# EAGLE design USBasp (EAGLE 5.07)
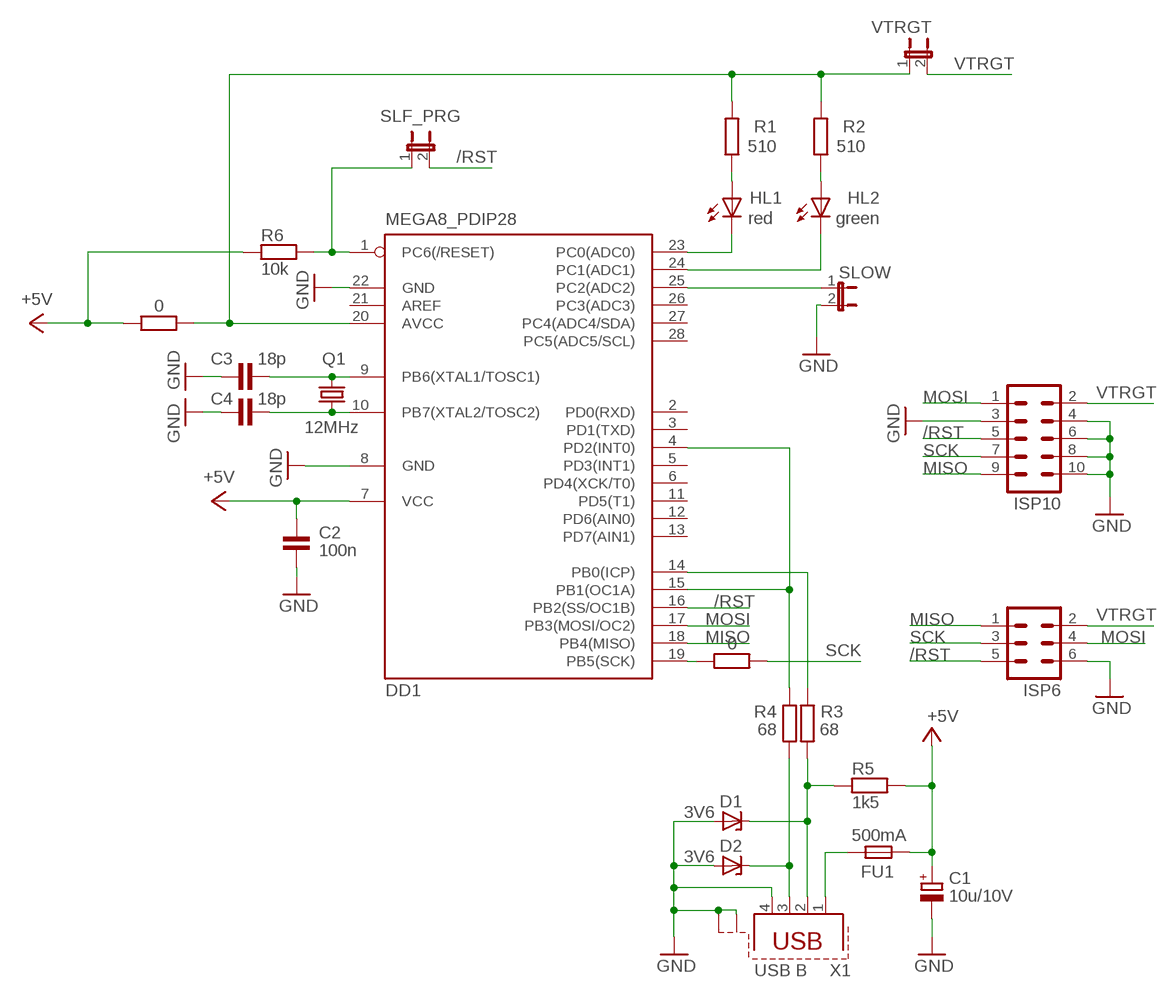
[diagram p0: schematic, sheet 1]

## Parts
C1  10u/10V  CPOL-EUSMCA  [SMC_A]
C2  100n  CAPACITOR_SMD1206  [C_SMD1206]
C3  18p  CAPACITOR_SMD1206  [C_SMD1206]
C4  18p  CAPACITOR_SMD1206  [C_SMD1206]
D1  3V6  1N4729_7.6MM  [ZD_7.6MM]
D2  3V6  1N4729_7.6MM  [ZD_7.6MM]
DD1  MEGA8_PDIP28  [DIL28]
FU1  500mA  MF-R  [TE5]
HL1  red  LED3MM  [LED3MM]
HL2  green  LED3MM  [LED3MM]
ISP6  MA03-2  [MA03-2]
ISP10  ML10_10L  [ML10L]
Q1  12MHz  CRYSTALHC49U-V  [HC49U-V]
R1  510  RESISTOR_SMD1206  [R_SMD1206]
R2  510  RESISTOR_SMD1206  [R_SMD1206]
R3  68  RESISTOR_SMD0805  [R_SMD0805]
R4  68  RESISTOR_SMD0805  [R_SMD0805]
R5  1k5  RESISTOR_SMD1206  [R_SMD1206]
R6  10k  RESISTOR_SMD1206  [R_SMD1206]
SLF_PRG  JP1E  [JP1]
SLOW  JP1E  [JP1]
U$1  R0_SMD1206  [R0_SMD1206]
U$2  R0_SMD1206  [R0_SMD1206]
VTRGT  JP1E  [JP1]
X1  USB B  USB_B  [USB_B]

## Nets
/RST: DD1.16(PB2(SS/OC1B)) ISP6.5 ISP10.5 SLF_PRG.2
GND: C1.- C2.2 C3.1 C4.1 D1.A D2.A DD1.8(GND) DD1.22(GND) ISP6.6 ISP10.3 ISP10.4 ISP10.6 ISP10.8 ISP10.10 SLOW.2 X1.4 X1.S1 X1.S2
MISO: DD1.18(PB4(MISO)) ISP6.1 ISP10.9
MOSI: DD1.17(PB3(MOSI/OC2)) ISP6.4 ISP10.1
N$1: DD1.23(PC0(ADC0)) HL1.K(C)
N$2: HL1.A R1.1
N$3: HL2.A R2.1
N$4: DD1.24(PC1(ADC1)) HL2.K(C)
N$5: FU1.1 X1.1
N$9: DD1.14(PB0(ICP)) R3.2
N$10: D1.C R3.1 R5.2 X1.2
N$11: C3.2 DD1.9(PB6(XTAL1/TOSC1)) Q1.2
N$12: D2.C R4.1 X1.3
N$14: DD1.4(PD2(INT0)) DD1.15(PB1(OC1A)) R4.2
N$15: C4.2 DD1.10(PB7(XTAL2/TOSC2)) Q1.1
N$16: DD1.19(PB5(SCK)) U$2.1
N$17: DD1.25(PC2(ADC2)) SLOW.1
N$21: DD1.20(AVCC) R1.2 R2.2 U$1.2 VTRGT.1
RST: DD1.1(PC6(/RESET)) R6.1 SLF_PRG.1
SCK: ISP6.3 ISP10.7 U$2.2
VCC: C1.+ C2.1 DD1.7(VCC) FU1.2 R5.1 R6.2 U$1.1 ; supply symbol labelled +5V
VTRGT: ISP6.2 ISP10.2 VTRGT.2
Unconnected: DD1.2(PD0(RXD)) DD1.3(PD1(TXD)) DD1.5(PD3(INT1)) DD1.6(PD4(XCK/T0)) DD1.11(PD5(T1)) DD1.12(PD6(AIN0)) DD1.13(PD7(AIN1)) DD1.21(AREF) DD1.26(PC3(ADC3)) DD1.27(PC4(ADC4/SDA)) DD1.28(PC5(ADC5/SCL))

## Library data of the parts
C1 = RLC:CPOL-EU: POLARIZED CAPACITOR, European symbol
C2-C4 = RLC:CAPACITOR_: Capacitor
D1 D2 = Diode:1N4729_: Zener Diode 3V6, 1W, 5 percent
DD1 = AVR:MEGA8_: MICROCONTROLLER 8 Kbytes FLASH, 1 kbytes SRAM, 512 bytes EEPROM, USART, 4-channel 10 bit ADC, 2-channel 8 bit ADC Pin compatible with Atmega48, ATMega88, ATMega168 Source: avr.lbr
FU1 = Fuse:MF-R: Resettable Fuse Bourns
HL1 HL2 = led:LED: LED OSRAM: - CHIPLED LG R971, LG N971, LY N971, LG Q971, LY Q971, LO R971, LY R971 LH N974, LH R974 LS Q976, LO Q976, LY Q976 LO Q996 - Hyper CHIPLED LW Q18S LB Q993, LB Q99A, LB R99A - SideLED LS A670, LO A670, LY A670, LG A670, LP A670 LB A673, LV A673, LT A673, LW A673 LH A674 LY A675 LS A676, LA A676, LO A676, LY A676, LW A676 LS A679, LY A679, LG A679 - Hyper Micro SIDELED® LS Y876, LA Y876, LO Y876, LY Y876 LT Y87S - SmartLED LW L88C, LW L88S LB L89C, LB L89S, LG L890 LS L89K, LO L89K, LY L89K LS L896, LA L896, LO L896, LY L896 - TOPLED LS T670, LO T670, LY T670, LG T670, LP T670 LSG T670, LSP T670, LSY T670, LOP T670, LYG T670 LG T671, LOG T671, LSG T671 LB T673, LV T673, LT T673, LW T673 LH T674 LS T676, LA T676, LO T676, LY T676, LB T676, LH T676, LSB T676, LW T676 LB T67C, LV T67C, LT T67C, LS T67K, LO T67K, LY T67K, LW E67C LS E67B, LA E67B, LO E67B, LY E67B, LB E67C, LV E67C, LT E67C LW T67C LS T679, LY T679, LG T679 LS T770, LO T770, LY T770, LG T770, LP T770 LB T773, LV T773, LT T773, LW T773 LH T774 LS E675, LA E675, LY E675, LS T675 LS T776, LA T776, LO T776, LY T776, LB T776 LHGB T686 LT T68C, LB T68C - Hyper Mini TOPLED® LB M676 - Mini TOPLED Santana® LG M470 LS M47K, LO M47K, LY M47K Source: http://www.osram.convergy.de LUXEON: - LUMILED® LXK2-PW12-R00, LXK2-PW12-S00, LXK2-PW14-U00, LXK2-PW14-V00 LXK2-PM12-R00, LXK2-PM12-S00, LXK2-PM14-U00 LXK2-PE12-Q00, LXK2-PE12-R00, LXK2-PE12-S00, LXK2-PE14-T00, LXK2-PE14-U00 LXK2-PB12-K00, LXK2-PB12-L00, LXK2-PB12-M00, LXK2-PB14-N00, LXK2-PB14-P00, LXK2-PB14-Q00 LXK2-PR12-L00, LXK2-PR12-M00, LXK2-PR14-Q00, LXK2-PR14-R00 LXK2-PD12-Q00, LXK2-PD12-R00, LXK2-PD12-S00 LXK2-PH12-R00, LXK2-PH12-S00 LXK2-PL12-P00, LXK2-PL12-Q00, LXK2-PL12-R00 Source: www.luxeon.com KINGBRIGHT: KA-3528ASYC Source: www.kingbright.com
ISP6 = con-lstb:MA03-2: PIN HEADER
ISP10 = ISP-connector:ML10_: HARTING
Q1 = Crystal:CRYSTAL: CRYSTAL
R1-R6 = RLC:RESISTOR_: Resistor
SLF_PRG SLOW VTRGT = jumper:JP1E: JUMPER
U$1 U$2 = RLC:R0_: Resistor 0 Ohm
X1 = USB-connector:USB_B: USB B connector

## Board
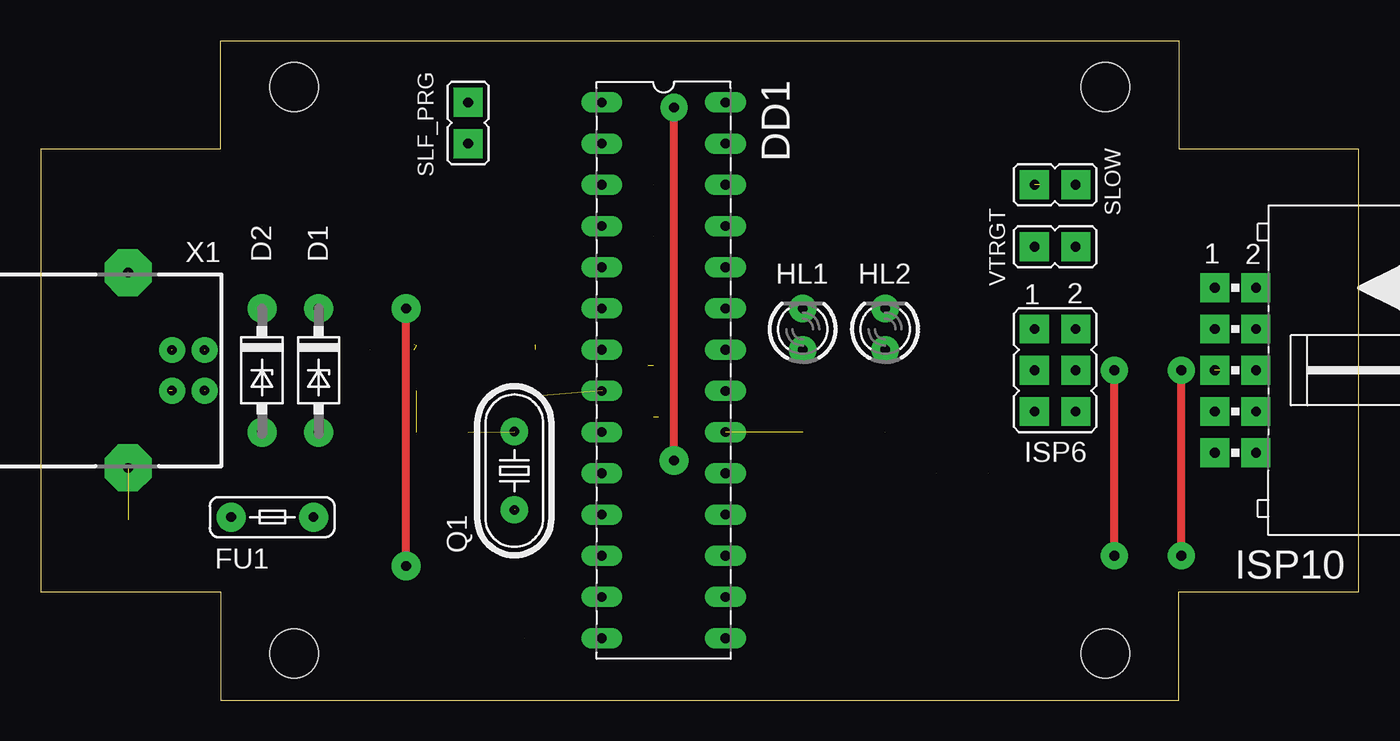
[diagram p1: board, top side]
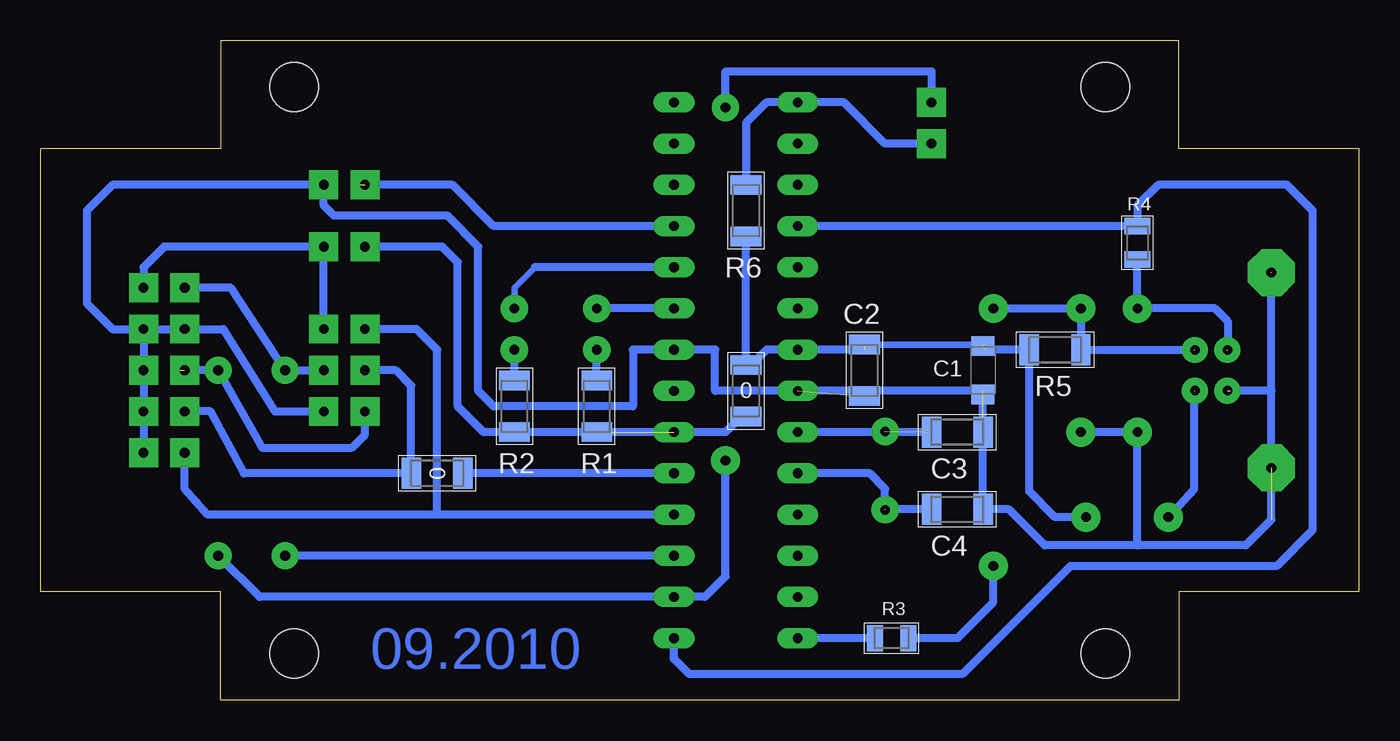
[diagram p2: board, bottom side, seen from below]

Size 81.28 x 40.64 mm. Coordinates in mm from the lower left corner, seen from the top.
Outline: 11.11,40.64 70.17,40.64 70.17,33.97 81.28,33.97 81.28,6.67 70.17,6.67 70.17,0 11.11,0 11.11,6.67 0,6.67 0,33.97 11.11,33.97 11.11,40.64
Copper layers (1*16): Top 0.035mm / dielectric 1.5mm / Bottom 0.035mm
Design rules "voventus *": minimum track width 0.3mm, minimum drill 0.6mm, track to track 8mil, track to pad 8mil, pad to pad 8mil, via to via 8mil, smd to smd 8mil, copper to edge 40mil, drill to drill 8mil, minimum pad ring 10mil, minimum via ring 8mil, stop-mask expansion 4mil, vias tented up to drill 0mil, thermal gap 10mil
Holes 3 mm at 65.64,2.86 65.64,37.78 15.64,37.78 15.64,2.86

### Footprints (pad centres in the part's own frame; a part is rotated, then mirrored left to right if it is on the bottom)
SMC_A = smd 1.2 x 1.4: + -1.5,0; - 1.5,0
C_SMD1206 = smd 1.2 x 1.9: 1 -1.587,0; 2 1.587,0
ZD_7.6MM = drill 0.6 pad 1.778 round: A 3.81,0; C -3.81,0
DIL28 = drill 0.6 pad 1.27 long: 1 -16.51,-3.81; 2 -13.97,-3.81; 3 -11.43,-3.81; 4 -8.89,-3.81; 5 -6.35,-3.81; 6 -3.81,-3.81; 7 -1.27,-3.81; 8 1.27,-3.81; 9 3.81,-3.81; 10 6.35,-3.81; 11 8.89,-3.81; 12 11.43,-3.81; 13 13.97,-3.81; 14 16.51,-3.81; 15 16.51,3.81; 16 13.97,3.81; 17 11.43,3.81; 18 8.89,3.81; 19 6.35,3.81; 20 3.81,3.81; 21 1.27,3.81; 22 -1.27,3.81; 23 -3.81,3.81; 24 -6.35,3.81; 25 -8.89,3.81; 26 -11.43,3.81; 27 -13.97,3.81; 28 -16.51,3.81
TE5 = drill 0.6 pad 1.778 round: 1 -2.54,0; 2 2.54,0
LED3MM = drill 0.6 pad 1.676 round: A -1.27,0; K 1.27,0
MA03-2 = drill 0.6 pad 1.778 square: 1 -2.54,-1.27; 2 -2.54,1.27; 3 0,-1.27; 4 0,1.27; 5 2.54,-1.27; 6 2.54,1.27
ML10L = drill 0.6 pad 1.778 square: 1 -5.08,-1.27; 2 -5.08,1.27; 3 -2.54,-1.27; 4 -2.54,1.27; 5 0,-1.27; 6 0,1.27; 7 2.54,-1.27; 8 2.54,1.27; 9 5.08,-1.27; 10 5.08,1.27
HC49U-V = drill 0.6 pad 1.676 round: 1 -2.413,0; 2 2.413,0
R_SMD1206 = smd 1.2 x 1.9: 1 -1.588,0; 2 1.588,0
R_SMD0805 = smd 1 x 1.6: 1 -1.111,0; 2 0.953,0
JP1 = drill 0.6 pad 1.778 square: 1 0,-1.27; 2 0,1.27
R0_SMD1206 = smd 1.2 x 1.9: 1 -1.587,0; 2 1.587,0
USB_B = drill 0.6 pad 1.6 round: 1 1.25,4.71; 2 -1.25,4.71; 3 -1.25,2.71; 4 1.25,2.71 | drill 0.6 pad 2.9 octagon: S1 -6.02,0; S2 6.02,0

### Placement (x,y rotation side)
C1  23.18,20.32 270 bottom
C2  30.48,20.32 270 bottom
C3  24.77,16.51 180 bottom
C4  24.77,11.75 180 bottom
D1  17.14,20.32 270 top
D2  13.65,20.32 270 top
DD1  38.42,20.32 270 top
FU1  14.29,11.27 0 top
HL1  46.99,22.86 90 top
HL2  52.07,22.86 90 top
ISP6  62.55,20.32 270 top
ISP10  73.66,20.32 270 top
Q1  29.21,14.13 90 top
R1  46.99,18.1 270 bottom
R2  52.07,18.1 270 bottom
R3  28.89,3.81 180 bottom
R4  13.65,28.26 90 bottom
R5  18.73,21.59 0 bottom
R6  37.78,30.16 270 bottom
SLF_PRG  26.35,35.56 0 top
SLOW  62.55,31.75 270 top
U$1  37.78,19.05 270 bottom
U$2  56.83,13.97 180 bottom
VTRGT  62.55,27.94 270 top
X1  5.4,20.32 270 top

### Tracks (layer width: path | path; a pad name or v marks a point on that pad's centre or on a via)
/RST  (via drill 0.6 pad 1.68, 0.6 pad 1.78)  (1 unrouted)
  Top 0.5: v39.05,14.76 v39.05,36.51 | v70.33,8.89 v70.33,20.32
  Bottom 0.406: v70.33,20.32
  Bottom 0.5: v39.05,36.51 39.05,38.73 26.35,38.73 SLF_PRG.2 | v39.05,14.76 39.05,7.62 40.32,6.35 DD1.16 67.79,6.35 v70.33,8.89 | ISP6.5 61.28,16.35 62.07,15.56 67.63,15.56 v70.33,20.32 72.71,20.32
GND  (6 unrouted)
  Bottom 0.5: 13.65,9.53 6.99,9.53 5.4,11.11 5.4,19.05 | 13.65,9.53 19.37,9.53 21.59,11.75 C4.1 23.18,19.05 DD1.8 39.69,19.05 39.69,21.59 DD1.22 44.77,21.59 44.77,18.1 53.34,18.1 54.29,19.05 54.29,27.94 56.2,29.84 63.18,29.84 63.82,30.48 SLOW.2 76.84,31.75 78.42,30.16 78.42,24.45 76.84,22.86 ISP10.4 | 5.4,19.05 X1.S1 | 5.4,19.05 7.94,19.05 | D1.A D2.A 13.65,9.53 | ISP6.6 66.83,17.78 70.01,22.86 ISP10.3 ISP10.4 | ISP10.4 ISP10.6 ISP10.8 ISP10.10
MISO
  Bottom 0.5: ISP6.1 58.1,22.86 56.83,21.59 56.83,14.29 56.83,11.43 | ISP10.9 72.39,13.02 70.96,11.43 58.42,11.43 56.83,11.43 | DD1.18 56.83,11.43
MOSI  (via drill 0.6 pad 1.68)
  Top 0.5: v66.2,8.89 v66.2,20.32
  Bottom 0.5: ISP6.4 v66.2,20.32 69.53,25.4 ISP10.1 | DD1.17 v66.2,8.89
N$1
  Bottom 0.5: DD1.23 HL1.K
N$2
  Bottom 0.5: R1.1 HL1.A
N$3
  Bottom 0.5: R2.1 HL2.A
N$4
  Bottom 0.406: HL2.K 52.07,25.4 50.8,26.67
  Bottom 0.5: DD1.24 50.8,26.67
N$5  (1 unrouted)
  Bottom 0.5: 10.16,19.05 10.16,13.02 FU1.1
N$9  (1 unrouted)
  Bottom 0.5: R3.2 DD1.14
N$10  (via drill 0.6 pad 1.78)  (2 unrouted)
  Top 0.5: v22.54,8.26 v22.54,24.13
  Bottom 0.5: 10.16,21.59 R5.2 D1.C v22.54,24.13 | v22.54,8.26 22.54,6.03 24.77,3.81 R3.1
N$11  (1 unrouted)
  Bottom 0.5: C3.2 DD1.9
N$12  (1 unrouted)
  Bottom 0.5: 8.1,21.59 8.1,23.34 8.89,24.13 D2.C R4.1
N$14  (1 unrouted)
  Bottom 0.5: DD1.15 42.23,2.54 41.27,1.59 24.45,1.59 17.78,8.26 5.08,8.26 2.86,10.48 2.86,30.16 4.45,31.75 12.38,31.75 13.65,30.48 R4.2 DD1.4
N$15  (1 unrouted)
  Bottom 0.5: DD1.10 30.16,13.97 29.21,13.02 29.21,11.75 C4.2
N$16  (1 unrouted)
  Bottom 0.5: DD1.19 U$2.1
N$17  (1 unrouted)
  Bottom 0.5: DD1.25 53.34,29.21 55.88,31.75 61.59,31.75
N$21  (3 unrouted)
  Bottom 0.5: 38.1,17.46 39.05,16.51 DD1.20 R2.2 53.97,16.51 55.56,18.1 55.56,26.99 56.51,27.94 VTRGT.1
RST  (1 unrouted)
  Bottom 0.406: R6.1 38.42,31.75
  Bottom 0.5: R6.1 37.78,35.56 36.51,36.83 DD1.1 31.75,36.83 29.21,34.29 SLF_PRG.1
SCK  (1 unrouted)
  Bottom 0.5: ISP6.3 59.37,20.32 58.42,19.37 U$2.2 68.74,13.97 70.8,17.78 ISP10.7
VCC  (6 unrouted)
  Bottom 0.406: 23.02,21.91 C2.1
  Bottom 0.5: 30.48,21.59 DD1.7 36.51,21.59 37.46,20.64 | U$1.1 R6.2 | FU1.2 18.73,11.27 20.32,12.86 R5.1 23.02,21.59
VTRGT
  Bottom 0.5: ISP10.2 74.93,26.67 73.66,27.94 VTRGT.2 ISP6.2

### Text on the board
Bottom: 09.2010